# Altium schematic sheet Mechanical.SchDoc
size A4; Organization: Altium Limited; Address1: L3, 12a Rodborough Rd; Address2: Frenchs Forest; Address3: NSW; Address4: Australia 2086
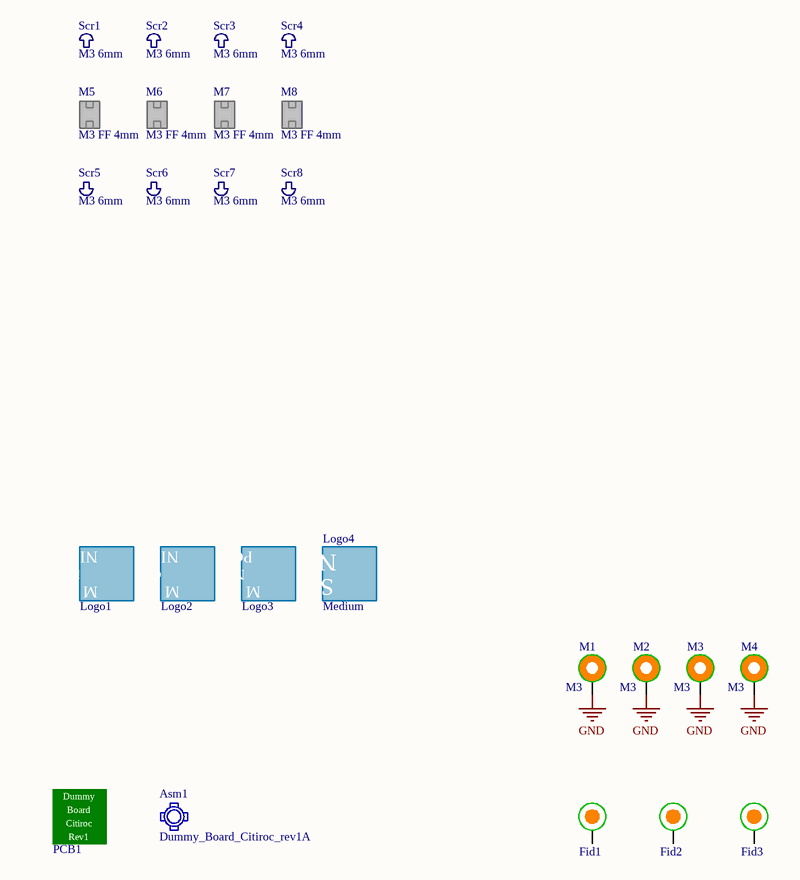
[diagram p0: Mechanical.SchDoc]

## Parts
Asm1  Dummy_Board_Citiroc_rev1A  (mechanical)
Fid1  PCB_Fiducial_Round_1mm  [PCB_Fiducial_Round_1mm]  (value not drawn)
Fid2  PCB_Fiducial_Round_1mm  [PCB_Fiducial_Round_1mm]  (value not drawn)
Fid3  PCB_Fiducial_Round_1mm  [PCB_Fiducial_Round_1mm]  (value not drawn)
Logo1  (no value)  [NI_ProjectName_M_Serigraphy]
Logo2  NI_COMPLETE_M_LOGO  [NI_COMPLETE_M_LOGO]  (value not drawn)
Logo3  PCB_Number_M  [NI_PCB_Number_M_Serigraphy]  (value not drawn)
Logo4  Medium  [NI_SN_MEDIUM]
M1  M3  [PCBPad_M3_Head6mm]
M2  M3  [PCBPad_M3_Head6mm]
M3  M3  [PCBPad_M3_Head6mm]
M4  M3  [PCBPad_M3_Head6mm]
M5  M3 FF 4mm  (mechanical)
M6  M3 FF 4mm  (mechanical)
M7  M3 FF 4mm  (mechanical)
M8  M3 FF 4mm  (mechanical)
PCB1  PCB_Dummy_Board_Citiroc_rev1  (value not drawn)  (mechanical)
Scr1  M3 6mm  (mechanical)
Scr2  M3 6mm  (mechanical)
Scr3  M3 6mm  (mechanical)
Scr4  M3 6mm  (mechanical)
Scr5  M3 6mm  (mechanical)
Scr6  M3 6mm  (mechanical)
Scr7  M3 6mm  (mechanical)
Scr8  M3 6mm  (mechanical)

## Nets
GND: M1.1 M2.1 M3.1 M4.1

Not connected (* = marked no-connect by the designer): Fid1 1; Fid2 1; Fid3 1

## Notes on the sheet
- Project Name:
- Revision:
- File Name:
- Date:
- Nuclear Instruments srl
- Via Lecco, 16, Lambrugo, Italy
- +39 031 2289570
- info@nuclearinstruments.eu
- http://www.nuclearinstruments.eu
- (in symbol NI_COMPLETE_M_LOGO) NI; Complete; M
- (in symbol NI_PCB_Number_M_Serigraphy) PCB; Number; M
- (in symbol NI_ProjectName_M_Serigraphy) NI; Proj Name; M
- (in symbol NI_SN_MEDIUM) NI; SN
- (in symbol PCB_Dummy_Board_Citiroc_rev1) Dummy; Board; Citiroc; Rev1

## Library data of the parts
Asm1 = Assembly_Dummy_Board_Citiroc_rev1A
Logo1 = NI_ProjectName_M_Serigraphy
Logo3 = NI_PCB_Number_M_Serigraphy
Logo4 = NI_SN_MEDIUM
M1-M4 = PCBPad_M3_Head6mm
M5-M8 = Hex_Spacer_R30_M3_FF_4mm
Scr1-Scr8 = Screw_M3_6mm_Pozi_Duratool